# Altium schematic sheet FSMSequence_SCH.SchDoc
size A4
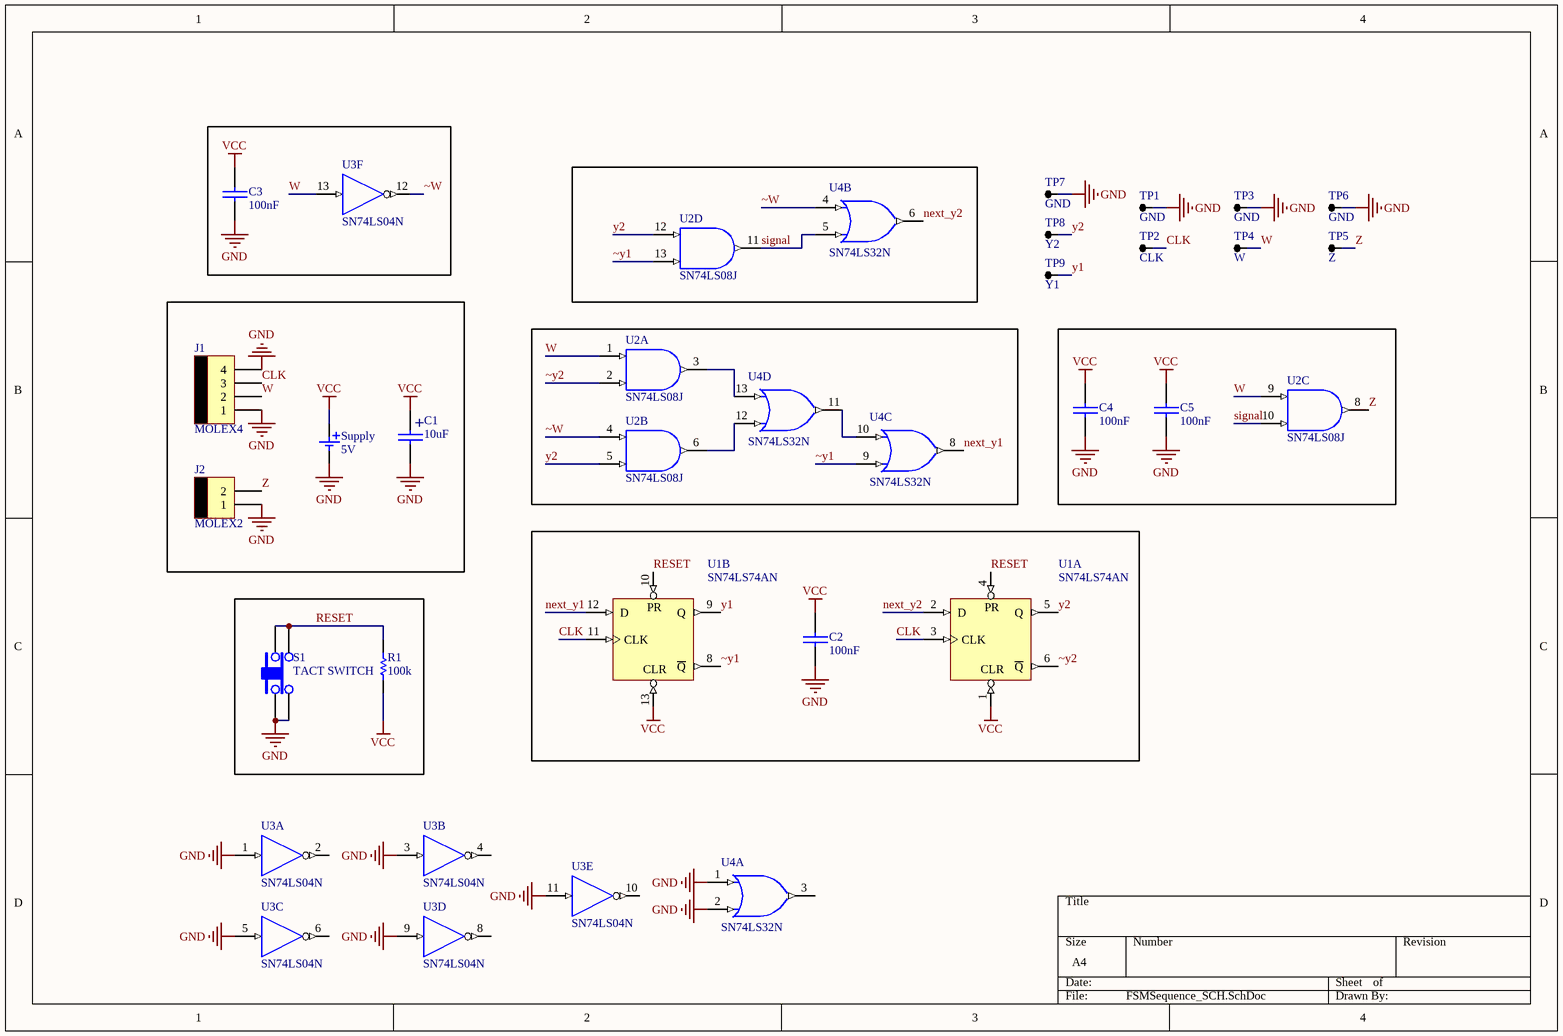
[diagram p0: FSMSequence_SCH.SchDoc]

## Parts
C1  10uF  [CAP100RP]
C2  100nF  [0805]
C3  100nF  [0805]
C4  100nF  [0805]
C5  100nF  [0805]
J1  MOLEX4  [MOLEX4]
J2  MOLEX2  [MOLEX2]
R1  100k  [0805]
S1  TACT SWITCH  [TACTSWITCH]
Supply  5V  [BORNERA2]
TP1  GND  [TPTH]
TP2  CLK  [TPTH]
TP3  GND  [TPTH]
TP4  W  [TPTH]
TP5  Z  [TPTH]
TP6  GND  [TPTH]
TP7  GND  [TPTH]
TP8  Y2  [TPTH]
TP9  Y1  [TPTH]
U1  SN74LS74AN  [N014D]  (parts A,B of 2)
U2  SN74LS08J  [J014]  (parts A,B,C,D of 4)
U3  SN74LS04N  [N014]  (parts A,B,C,D,E,F of 6)
U4  SN74LS32N  [N014]  (parts A,B,C,D of 4)

## Nets
GND: C1.2 C2.2 C3.2 C4.2 C5.2 J1.1 J1.4 J2.1 S1.1 S1.2 Supply.2 TP1.1 TP3.1 TP6.1 TP7.1 U1.7(GND) U2.7(GND) U3.1(A) U3.3(A) U3.5(A) U3.7(GND) U3.9(A) U3.11(A) U4.1(A) U4.2(B) U4.7(GND)
VCC: C1.1 C2.1 C3.1 C4.1 C5.1 R1.1 Supply.1 U1.1(CLR) U1.13(CLR) U1.14(VCC) U2.14(VCC) U3.14(VCC) U4.14(VCC)
CLK: J1.3 TP2.1 U1.3(CLK) U1.11(CLK)
next_y1: U1.12(D) U4.8(Y)
next_y2: U1.2(D) U4.6(Y)
RESET: R1.2 S1.3 S1.4 U1.4(PR) U1.10(PR)
signal: U2.10(B) U2.11(Y) U4.5(B)
W: J1.2 TP4.1 U2.1(A) U2.9(A) U3.13(A)
y1: TP9.1 U1.9(Q)
y2: TP8.1 U1.5(Q) U2.5(B) U2.12(A)
Z: J2.2 TP5.1 U2.8(Y)
~W: U2.4(A) U3.12(Y) U4.4(A)
~y1: U1.8(~{Q}) U2.13(B) U4.9(A)
~y2: U1.6(~{Q}) U2.2(B)
NetU2_3: U2.3(Y) U4.13(B)
NetU2_6: U2.6(Y) U4.12(A)
NetU4_10: U4.10(B) U4.11(Y)

Not connected (* = marked no-connect by the designer): U3 2(Y) 4(Y) 6(Y) 8(Y) 10(Y); U4 3(Y)

## Notes on the sheet
- (in symbol CAPPOL) +

## Library data of the parts
C1 = CAPPOL: Value: 10uF; Footprint: THT
C2-C5 = CAP: Footprint: SMD0805; Value: 100nF
J1 = MOLEX4: Value: ALOJAMIENTO POLARIZADO 4 PINES; Footprint: ALOJAMIENTO POLARIZADO 4 PINES
J2 = MOLEX2: Value: ALOJAMIENTO POLARIZADO 2 PINES; Footprint: ALOJAMIENTO POLARIZADO 2 PINES
R1 = RES: Value: 100k; Footprint: SMD0805
S1 = TACT SWITCH: Value: PULSADOR; Footprint: PULSADOR
Supply = BATERIA: Value: BORNERA2
TP1-TP9 = TP
U1 = SN74LS74AN: Dual D-Type Positive-Edge-Triggered Flip-Flop with Preset and Clear; Value: 74LS74; Footprint: DIP14
U2 = SN74LS08J: Quadruple 2-Input Positive-AND Gate; Value: 74LS08; Footprint: DIP14
U3 = SN74LS04N: Hex Inverter; Value: 74LS04; Footprint: DIP14
U4 = SN74LS32N: Quadruple 2-Input Positive-OR Gate; Value: 74LS32; Footprint: DIP14